# EAGLE design hello7 (EAGLE 4.15)
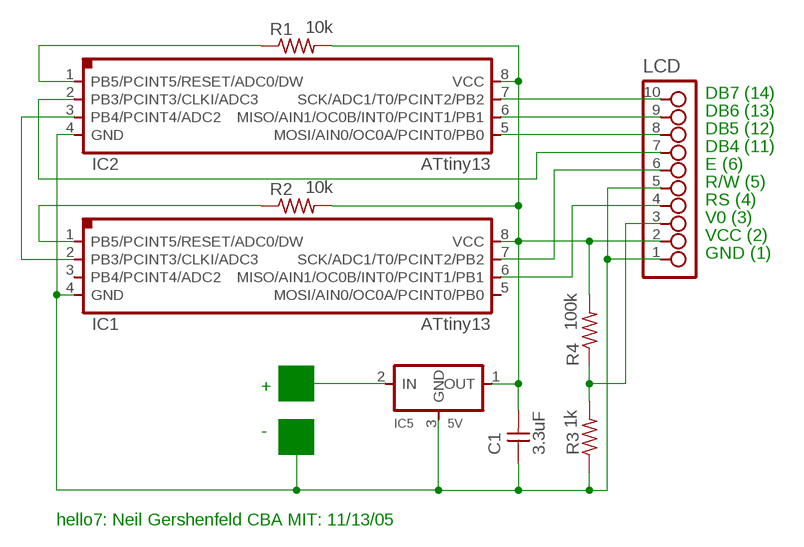
[diagram p0: schematic, sheet 1]

## Parts
C1  3.3uF  UNPOLARIZED_CAPACITOR1206  [1206]
IC1  ATTINY13SI  [SOIC8]
IC2  ATTINY13SI  [SOIC8]
IC5  5V  REGULATORSOT23  [SOT23]
LCD  10_PIN_HEADERHEADER  [SMT_PINS_10]
R1  10k  RESISTOR1206  [1206]
R2  10k  RESISTOR1206  [1206]
R3  1k  RESISTOR1206  [1206]
R4  100k  RESISTOR1206  [1206]

## Nets
N$1: IC2.7(SCK/ADC1/T0/PCINT2/PB2) LCD.10
N$2: C1.1 IC1.4(GND) IC2.4(GND) IC5.3(GND) LCD.1 LCD.5 R3.1
N$3: IC2.6(MISO/AIN1/OC0B/INT0/PCINT1/PB1) LCD.9
N$4: IC2.5(MOSI/AIN0/OC0A/PCINT0/PB0) LCD.8
N$5: IC2.2(PB3/PCINT3/CLKI/ADC3) LCD.7
N$6: C1.2 IC1.8(VCC) IC2.8(VCC) IC5.1(OUT) LCD.2 R1.2 R2.2 R4.2
N$7: IC1.7(SCK/ADC1/T0/PCINT2/PB2) LCD.6
N$8: IC1.6(MISO/AIN1/OC0B/INT0/PCINT1/PB1) LCD.4
N$11: LCD.3 R3.2 R4.1
N$12: IC5.2(IN)
N$13: IC2.1(PB5/PCINT5/RESET/ADC0/DW) R1.1
N$14: IC1.1(PB5/PCINT5/RESET/ADC0/DW) R2.1
N$15: IC1.2(PB3/PCINT3/CLKI/ADC3) IC2.3(PB4/PCINT4/ADC2)
Unconnected: IC1.3(PB4/PCINT4/ADC2) IC1.5(MOSI/AIN0/OC0A/PCINT0/PB0)

## Notes on the sheet
- DB7 (14)
- DB6 (13)
- DB5 (12)
- DB4 (11)
- E (6)
- R/W (5)
- RS (4)
- V0 (3)
- VCC (2)
- GND (1)
- +
- -
- hello7: Neil Gershenfeld CBA MIT: 11/13/05

## Library data of the parts
C1 = ng:UNPOLARIZED_CAPACITOR: unpolarized_capacitor
IC1 IC2 = ng:ATTINY13
IC5 = ng:REGULATOR
LCD = ng:10_PIN_HEADER
R1-R4 = ng:RESISTOR

## Board
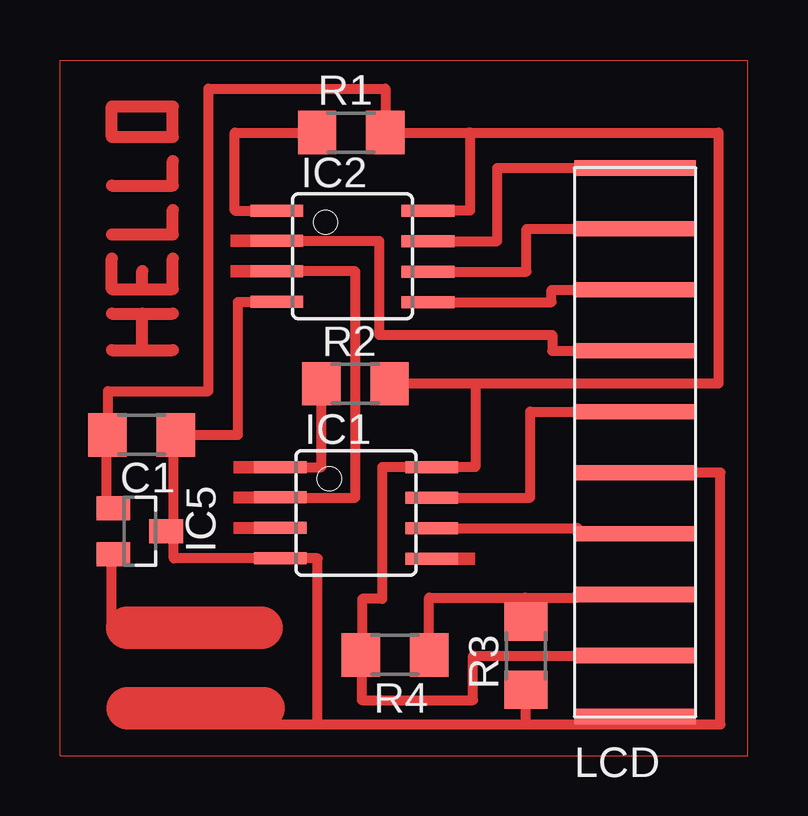
[diagram p1: board, top side]

No outline drawn. Coordinates in mm, seen from the top.
Copper layers (1*16): Top 0.035mm / dielectric 1.5mm / Bottom 0.035mm
Design rules "default": minimum track width 10mil, minimum drill 24mil, track to track 8mil, track to pad 8mil, pad to pad 8mil, via to via 8mil, smd to smd 8mil, copper to edge 40mil, drill to drill 8mil, minimum pad ring 10mil, minimum via ring 8mil, stop-mask expansion 4mil, vias tented up to drill 0mil, thermal gap 10mil

### Footprints (pad centres in the part's own frame; a part is rotated, then mirrored left to right if it is on the bottom)
1206 = smd 1.6 x 1.803: 1 -1.422,0; 2 1.422,0
SOIC8 = smd 0.5 x 2.2: 1 -1.905,-3.154; 2 -0.645,-3.154; 3 0.625,-3.154; 4 1.895,-3.154; 5 1.905,3.154; 6 0.635,3.154; 7 -0.635,3.154; 8 -1.905,3.154
SOT23 = smd 1 x 1.4: 1 -0.95,-1.1; 2 0.95,-1.1; 3 0,1.1
SMT_PINS_10 = smd 5.08 x 0.635: 1 0,0; 2 0,2.54; 3 0,5.08; 4 0,7.62; 5 0,10.16; 6 0,12.7; 7 0,15.24; 8 0,17.78; 9 0,20.32; 10 0,22.86

### Placement (x,y rotation side)
C1  3.51,13.36 180 top
IC1  12.45,10.11 270 top
IC2  12.29,20.8 270 top
IC5  3.43,9.35 270 top
LCD  24.08,1.63 0 top
R1  12.24,25.96 0 top
R2  12.42,15.49 0 top
R3  19.53,4.17 90 top
R4  14.07,4.19 180 top

### Tracks (layer width: path | path; a pad name or v marks a point on that pad's centre or on a via)
N$1
  Top 0.406: IC2.7 18.34,21.44 18.34,24.49 LCD.10
N$2
  Top 0.406: 4.85,13.36 4.85,13.51 | 4.85,13.36 C1.1 7.52,13.36 7.52,18.91 IC2.4 | 4.85,9.35 4.85,13.36 | 4.85,9.35 IC5.3 | 4.85,9.35 4.85,8.21 IC1.4 10.85,8.21 10.85,1.29 | 19.53,2.97 R3.1 19.53,1.29 | LCD.5 27.64,11.79 27.64,1.29 24.08,1.29 | 10.85,1.29 19.53,1.29 | 19.53,1.29 24.08,1.29 | 24.08,1.29 LCD.1 | 10.85,1.29 8.59,1.29 8.59,1.98
  Top 1.778: 2.92,1.98 8.59,1.98
N$3
  Top 0.406: IC2.6 19.56,20.17 19.56,21.95 LCD.9
N$4
  Top 0.406: IC2.5 20.6,18.9 20.6,19.41 LCD.8
N$5
  Top 0.406: IC2.2 13.41,21.45 13.41,17.53 20.62,17.53 20.62,16.87 LCD.7
N$6
  Top 0.406: 17.14,25.96 17.2,25.96 17.2,22.71 15.37,22.71 | R1.2 17.14,25.96 | 15.37,22.71 IC2.8 | 15.37,22.71 15.37,22.68 | 17.42,15.49 R2.2 | 17.42,15.49 17.42,12.01 | 17.42,12.01 IC1.8 15.54,12.01 | 2.11,13.36 2.11,13.41 | 2.11,13.36 C1.2 2.06,13.36 | 2.11,10.3 IC5.1 2.06,10.3 2.06,13.36 | LCD.2 17.32,4.17 17.32,2.31 12.68,2.31 12.68,4.19 R4.2 12.7,4.19 12.7,6.53 13.54,6.53 13.54,12.01 17.42,12.01 | 17.42,15.49 27.56,15.49 27.56,25.96 17.14,25.96 | 2.11,13.36 2.11,15.19 6.3,15.19 6.3,27.79 13.66,27.79 R1.2 | R1.2 | 2.06,13.36 2.06,13.41
N$7
  Top 0.406: IC1.7 19.71,10.74 19.71,14.33 LCD.6 24.13,14.33
N$8
  Top 0.406: IC1.6 21.69,9.47 21.69,9.25 LCD.4
N$10
  Top 0: 0.1,0 0.1,28.98 28.78,28.98 28.78,0 0.1,0
N$11
  Top 0.406: LCD.3 21.67,6.71 21.67,6.58 19.51,6.58 | R4.1 | R4.1 15.49,6.58 19.51,6.58 | 19.51,5.59 | 19.51,5.59 19.51,5.49 | 19.51,5.59 R3.2 | 19.51,6.58 19.51,5.59
N$13
  Top 0.406: R1.1 7.39,25.96 7.39,22.71 IC2.1
N$14
  Top 0.406: R2.1 11,12.01 IC1.1
N$15
  Top 0.406: IC2.3 12.42,20.18 12.42,10.74 IC1.2
N$16
  Top 0.406: 2.26,8.31 2.26,5.33 2.9,5.33
  Top 1.778: 2.9,5.33 8.51,5.33
N$17
  Top 0.508: 3.53,16.89 4.8,16.89 | 2.26,16.89 3.53,16.89 | 3.53,16.89 3.53,18.41
N$19
  Top 0.508: 2.26,18.41 4.8,18.41
N$20
  Top 0.508: 3.53,19.43 2.26,19.43 2.26,20.7 | 3.53,19.43 4.8,19.43 4.8,20.7 | 3.53,19.43 3.53,20.19
N$21
  Top 0.508: 2.26,21.72 4.8,21.72 4.8,22.73
N$22
  Top 0.508: 2.26,23.75 4.8,23.75 4.8,24.77
N$23
  Top 0.508: 4.8,25.78 4.8,27.05 2.26,27.05 2.26,25.78 4.8,25.78
(copper drawn outside any net)
  shapes: Top area x6